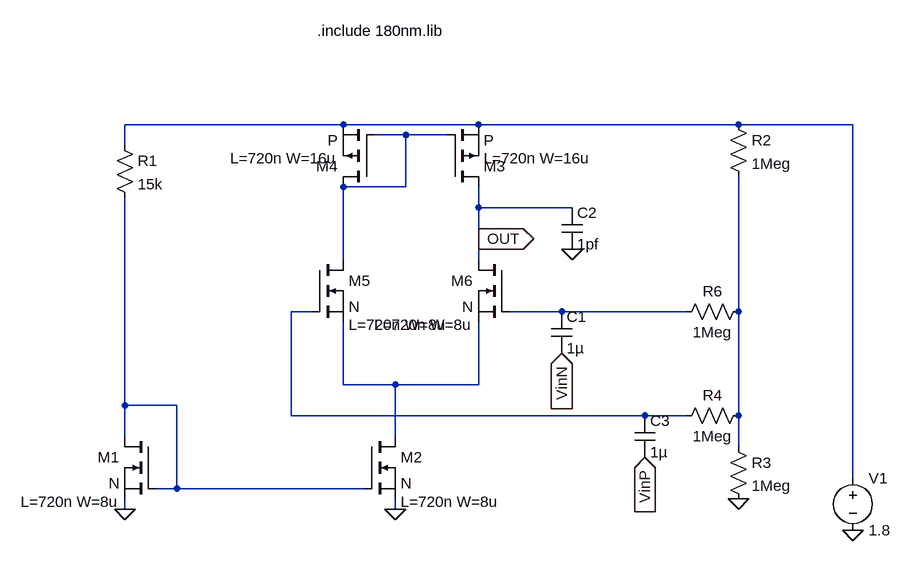
[diagram p0: schematic DiffAmp.asc]
DiffAmp.asc, the LTspice schematic file:
Version 4.1
SHEET 1 1120 724
WIRE -464 64 -800 64
WIRE -256 64 -464 64
WIRE 144 64 -256 64
WIRE 320 64 144 64
WIRE -368 80 -416 80
WIRE -304 80 -368 80
WIRE -800 96 -800 64
WIRE -368 160 -368 80
WIRE -368 160 -464 160
WIRE -256 192 -256 160
WIRE -112 192 -256 192
WIRE -256 240 -256 192
WIRE -464 272 -464 160
WIRE -256 272 -256 240
WIRE -512 352 -544 352
WIRE -128 352 -208 352
WIRE 64 352 -128 352
WIRE 144 352 144 144
WIRE -464 464 -464 368
WIRE -384 464 -464 464
WIRE -256 464 -256 368
WIRE -256 464 -384 464
WIRE -800 496 -800 176
WIRE -720 496 -800 496
WIRE -544 512 -544 352
WIRE 0 512 -544 512
WIRE 64 512 0 512
WIRE 144 512 144 352
WIRE -800 544 -800 496
WIRE -384 544 -384 464
WIRE 144 560 144 512
WIRE 320 608 320 64
WIRE -720 624 -720 496
WIRE -720 624 -752 624
WIRE -432 624 -720 624
WIRE -800 656 -800 640
WIRE -384 656 -384 640
FLAG 320 688 0
FLAG -112 256 0
FLAG -256 240 OUT
IOPIN -256 240 Out
FLAG -800 656 0
FLAG -384 656 0
FLAG 144 640 0
FLAG 0 576 VinP
IOPIN 0 576 In
FLAG -128 416 VinN
IOPIN -128 416 In
SYMBOL voltage 320 592 R0
SYMATTR InstName V1
SYMATTR Value 1.8
SYMBOL pmos -304 160 M180
WINDOW 39 56 44 Left 2
SYMATTR InstName M3
SYMATTR Value P
SYMATTR SpiceLine L=720n W=16u
SYMBOL pmos -416 160 R180
WINDOW 39 56 44 Left 2
SYMATTR InstName M4
SYMATTR Value P
SYMATTR SpiceLine L=720n W=16u
SYMBOL nmos -512 272 R0
WINDOW 39 56 100 Left 2
SYMATTR InstName M5
SYMATTR Value N
SYMATTR SpiceLine L=720n W=8u
SYMBOL nmos -208 272 M0
WINDOW 39 56 100 Left 2
SYMATTR InstName M6
SYMATTR Value N
SYMATTR SpiceLine L=720n W=8u
SYMBOL cap -128 192 R0
SYMATTR InstName C2
SYMATTR Value 1pf
SYMBOL res -816 80 R0
SYMATTR InstName R1
SYMATTR Value 15k
SYMBOL nmos -752 544 M0
WINDOW 39 56 100 Left 2
SYMATTR InstName M1
SYMATTR Value N
SYMATTR SpiceLine L=720n W=8u
SYMBOL nmos -432 544 R0
WINDOW 39 56 100 Left 2
SYMATTR InstName M2
SYMATTR Value N
SYMATTR SpiceLine L=720n W=8u
SYMBOL res 128 48 R0
SYMATTR InstName R2
SYMATTR Value 1Meg
SYMBOL res 128 544 R0
SYMATTR InstName R3
SYMATTR Value 1Meg
SYMBOL res 160 336 R90
WINDOW 0 0 56 VBottom 2
WINDOW 3 32 56 VTop 2
SYMATTR InstName R6
SYMATTR Value 1Meg
SYMBOL cap -144 352 R0
SYMATTR InstName C1
SYMATTR Value 1µ
SYMBOL res 160 496 R90
WINDOW 0 0 56 VBottom 2
WINDOW 3 32 56 VTop 2
SYMATTR InstName R4
SYMATTR Value 1Meg
SYMBOL cap -16 512 R0
SYMATTR InstName C3
SYMATTR Value 1µ
TEXT -504 -80 Left 2 !.include 180nm.lib

The netlist it stands for:
* DiffAmp.asc
V1 N001 0 1.8
M3 OUT N002 N001 N001 P L=720n W=16u
M4 N002 N002 N001 N001 P L=720n W=16u
M5 N002 N003 N006 N006 N L=720n W=8u
M6 OUT N004 N006 N006 N L=720n W=8u
C2 OUT 0 1pf
R1 N001 N007 15k
M1 N007 N007 0 0 N L=720n W=8u
M2 N006 N007 0 0 N L=720n W=8u
R2 N001 N005 1Meg
R3 N005 0 1Meg
R6 N005 N004 1Meg
C1 N004 VinN 1µ
R4 N005 N003 1Meg
C3 N003 VinP 1µ
.model NMOS NMOS
.model PMOS PMOS
.lib standard.mos
.include 180nm.lib
.backanno
.end